# Altium schematic sheet IC_DISPLAY_SCHE.SchDoc
size B; SheetNumber: 2; SheetTotal: 3
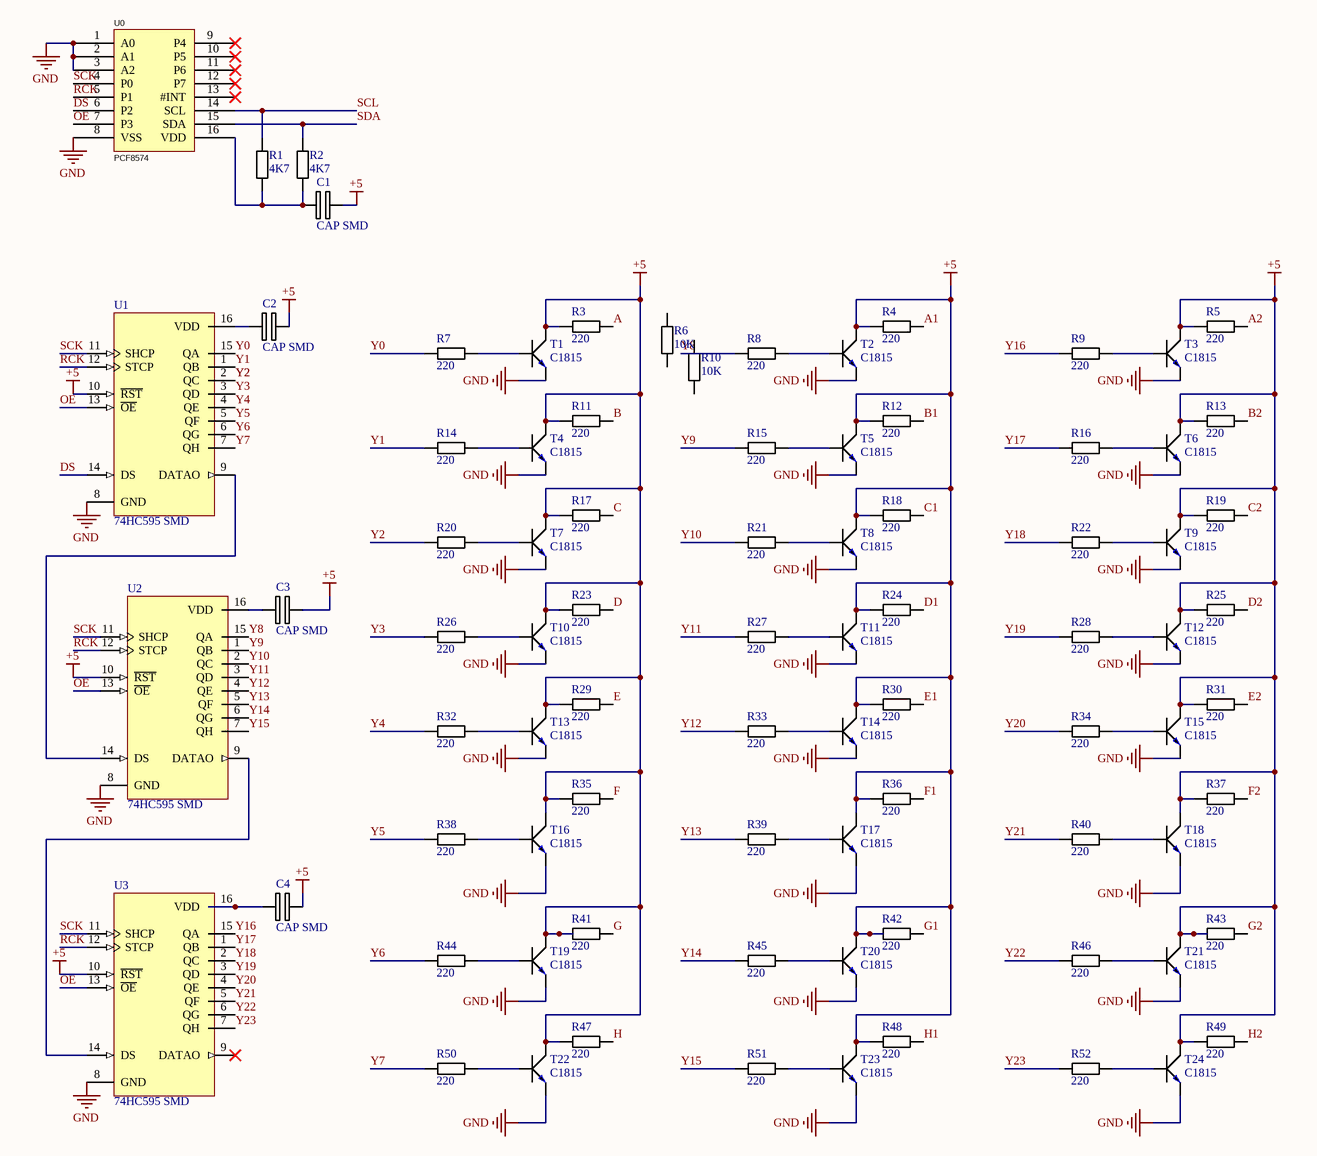
[diagram p0: IC_DISPLAY_SCHE.SchDoc]

## Parts
C1  CAP SMD  [C-0805]
C2  CAP SMD  [C-0805]
C3  CAP SMD  [C-0805]
C4  CAP SMD  [C-0805]
R1  4K7  [Resistor 0805]
R2  4K7  [Resistor 0805]
R3  220  [Resistor 0805]
R4  220  [Resistor 0805]
R5  220  [Resistor 0805]
R6  10K  [RES Axial 0.5W_10.16mm]
R7  220  [Resistor 0805]
R8  220  [Resistor 0805]
R9  220  [Resistor 0805]
R10  10K  [RES Axial 0.5W_10.16mm]
R11  220  [Resistor 0805]
R12  220  [Resistor 0805]
R13  220  [Resistor 0805]
R14  220  [Resistor 0805]
R15  220  [Resistor 0805]
R16  220  [Resistor 0805]
R17  220  [Resistor 0805]
R18  220  [Resistor 0805]
R19  220  [Resistor 0805]
R20  220  [Resistor 0805]
R21  220  [Resistor 0805]
R22  220  [Resistor 0805]
R23  220  [Resistor 0805]
R24  220  [Resistor 0805]
R25  220  [Resistor 0805]
R26  220  [Resistor 0805]
R27  220  [Resistor 0805]
R28  220  [Resistor 0805]
R29  220  [Resistor 0805]
R30  220  [Resistor 0805]
R31  220  [Resistor 0805]
R32  220  [Resistor 0805]
R33  220  [Resistor 0805]
R34  220  [Resistor 0805]
R35  220  [Resistor 0805]
R36  220  [Resistor 0805]
R37  220  [Resistor 0805]
R38  220  [Resistor 0805]
R39  220  [Resistor 0805]
R40  220  [Resistor 0805]
R41  220  [Resistor 0805]
R42  220  [Resistor 0805]
R43  220  [Resistor 0805]
R44  220  [Resistor 0805]
R45  220  [Resistor 0805]
R46  220  [Resistor 0805]
R47  220  [Resistor 0805]
R48  220  [Resistor 0805]
R49  220  [Resistor 0805]
R50  220  [Resistor 0805]
R51  220  [Resistor 0805]
R52  220  [Resistor 0805]
T1  C1815  [SOT23-BCE]
T2  C1815  [SOT23-BCE]
T3  C1815  [SOT23-BCE]
T4  C1815  [SOT23-BCE]
T5  C1815  [SOT23-BCE]
T6  C1815  [SOT23-BCE]
T7  C1815  [SOT23-BCE]
T8  C1815  [SOT23-BCE]
T9  C1815  [SOT23-BCE]
T10  C1815  [SOT23-BCE]
T11  C1815  [SOT23-BCE]
T12  C1815  [SOT23-BCE]
T13  C1815  [SOT23-BCE]
T14  C1815  [SOT23-BCE]
T15  C1815  [SOT23-BCE]
T16  C1815  [SOT23-BCE]
T17  C1815  [SOT23-BCE]
T18  C1815  [SOT23-BCE]
T19  C1815  [SOT23-BCE]
T20  C1815  [SOT23-BCE]
T21  C1815  [SOT23-BCE]
T22  C1815  [SOT23-BCE]
T23  C1815  [SOT23-BCE]
T24  C1815  [SOT23-BCE]
U0  PCF8574  [SOIC-16-pcf8574]
U1  74HC595 SMD  [SOP 16]
U2  74HC595 SMD  [SOP 16]
U3  74HC595 SMD  [SOP 16]

## Nets
+5: C1.2(-) C2.2(-) C3.2(-) C4.2(-) R3.2 R4.2 R5.2 R11.2 R12.2 R13.2 R17.2 R18.2 R19.2 R23.2 R24.2 R25.2 R29.2 R30.2 R31.2 R35.2 R36.2 R37.2 R41.2 R42.2 R43.2 R47.2 R48.2 R49.2 T1.2(C) T2.2(C) T3.2(C) T4.2(C) T5.2(C) T6.2(C) T7.2(C) T8.2(C) T9.2(C) T10.2(C) T11.2(C) T12.2(C) T13.2(C) T14.2(C) T15.2(C) T16.2(C) T17.2(C) T18.2(C) T19.2(C) T20.2(C) T21.2(C) T22.2(C) T23.2(C) T24.2(C) U1.10(~{RST}) U2.10(~{RST}) U3.10(~{RST})
GND: T1.3(E) T2.3(E) T3.3(E) T4.3(E) T5.3(E) T6.3(E) T7.3(E) T8.3(E) T9.3(E) T10.3(E) T11.3(E) T12.3(E) T13.3(E) T14.3(E) T15.3(E) T16.3(E) T17.3(E) T18.3(E) T19.3(E) T20.3(E) T21.3(E) T22.3(E) T23.3(E) T24.3(E) U0.1(A0) U0.2(A1) U0.3(A2) U0.8(VSS) U1.8(GND) U2.8(GND) U3.8(GND)
A: R3.1
A1: R4.1
A2: R5.1
B: R11.1
B1: R12.1
B2: R13.1
C: R17.1
C1: R18.1
C2: R19.1
D: R23.1
D1: R24.1
D2: R25.1
DS: U0.6(P2) U1.14(DS)
E: R29.1
E1: R30.1
E2: R31.1
F: R35.1
F1: R36.1
F2: R37.1
G: R41.1
G1: R42.1
G2: R43.1
H: R47.1
H1: R48.1
H2: R49.1
OE: U0.7(P3) U1.13(~{OE}) U2.13(~{OE}) U3.13(~{OE})
RCK: U0.5(P1) U1.12(STCP) U2.12(STCP) U3.12(STCP)
SCK: U0.4(P0) U1.11(SHCP) U2.11(SHCP) U3.11(SHCP)
SCL: R1.2 U0.14(SCL)
SDA: R2.2 U0.15(SDA)
Y0: R7.2 U1.15(QA)
Y1: R14.2 U1.1(QB)
Y2: R20.2 U1.2(QC)
Y3: R26.2 U1.3(QD)
Y4: R32.2 U1.4(QE)
Y5: R38.2 U1.5(QF)
Y6: R44.2 U1.6(QG)
Y7: R50.2 U1.7(QH)
Y8: R8.2 U2.15(QA)
Y9: R15.2 U2.1(QB)
Y10: R21.2 U2.2(QC)
Y11: R27.2 U2.3(QD)
Y12: R33.2 U2.4(QE)
Y13: R39.2 U2.5(QF)
Y14: R45.2 U2.6(QG)
Y15: R51.2 U2.7(QH)
Y16: R9.2 U3.15(QA)
Y17: R16.2 U3.1(QB)
Y18: R22.2 U3.2(QC)
Y19: R28.2 U3.3(QD)
Y20: R34.2 U3.4(QE)
Y21: R40.2 U3.5(QF)
Y22: R46.2 U3.6(QG)
Y23: R52.2 U3.7(QH)
NetC1_1: C1.1(+) R1.1 R2.1 U0.16(VDD)
NetC2_1: C2.1(+) U1.16(VDD)
NetC3_1: C3.1(+) U2.16(VDD)
NetC4_1: C4.1(+) U3.16(VDD)
NetR7_1: R7.1 T1.1(B)
NetR8_1: R8.1 T2.1(B)
NetR9_1: R9.1 T3.1(B)
NetR14_1: R14.1 T4.1(B)
NetR15_1: R15.1 T5.1(B)
NetR16_1: R16.1 T6.1(B)
NetR20_1: R20.1 T7.1(B)
NetR21_1: R21.1 T8.1(B)
NetR22_1: R22.1 T9.1(B)
NetR26_1: R26.1 T10.1(B)
NetR27_1: R27.1 T11.1(B)
NetR28_1: R28.1 T12.1(B)
NetR32_1: R32.1 T13.1(B)
NetR33_1: R33.1 T14.1(B)
NetR34_1: R34.1 T15.1(B)
NetR38_1: R38.1 T16.1(B)
NetR39_1: R39.1 T17.1(B)
NetR40_1: R40.1 T18.1(B)
NetR44_1: R44.1 T19.1(B)
NetR45_1: R45.1 T20.1(B)
NetR46_1: R46.1 T21.1(B)
NetR50_1: R50.1 T22.1(B)
NetR51_1: R51.1 T23.1(B)
NetR52_1: R52.1 T24.1(B)
NetU1_9: U1.9(DATAO) U2.14(DS)
NetU2_9: U2.9(DATAO) U3.14(DS)

Not connected (* = marked no-connect by the designer): R6 1 2; R10 1 2; U0 9(P4)* 10(P5)* 11(P6)* 12(P7)* 13(#INT)*; U3 9(DATAO)*

## Library data of the parts
C1-C4 = CAP SMD: Capacitor Polarised; Manufacturer_Name: AVX; Manufacturer_Part_Number: TAJC227K006RNJV; Datasheet Link: http://datasheets.avx.com/TAJ.pdf; Height: 2.8mm; Arrow Part Number: TAJC227K006RNJV; Arrow Price/Stock: https://www.arrow.com/en/products/tajc227k006rnjv/avx; Mouser Part Number: 581-TAJC227K006RNJV; Mouser Price/Stock: https://www.mouser.co.uk/ProductDetail/AVX/TAJC227K006RNJV?qs=k4kUdCzLgS5cVBAajWRJdQ%3D%3D
R1-R52 = Resistor
T1-T24 = 2SC1815: Bipolar Transistors - BJT NPN Epitaxial Sil
U0 = PCF8574AT/3: Manufacturer: NXP(恩智浦); Symbol: PCF8574AT/3,518; Add into BOM: yes; Interface: I2C; Number of I/O: 8; Interrupt Output: 有中断输出; Supply Voltage: 2.5V~6V; Output Source current: 300uA; Output Sink Current: 25mA; Clock Frequency: 100kHz; Device: PCF8574AT/3,518; LCSC Part Name: PCF8574AT/3,518; Supplier Part: C86832; Manufacturer Part: PCF8574AT/3,518; Supplier Footprint: SOIC-16-300mil; JLCPCB Part Class: Extended Part; Datasheet: https://atta.szlcsc.com/upload/public/pdf/source/20171113/C86832_15105616506391116137.pdf; Supplier: LCSC; Convert to PCB: yes; Operating Temperature: -40℃~+85℃
U1-U3 = 74HC595 SMD: Dán; Ten_Linh_Kien: 74HC595D SOP16; Don_Vi: Con; Ma_Hang: MH000672; Ghi_Chu: *; Kieu_Chan: *; Chung_Loai: Dán